# EasyEDA Pro project C116.epro

# Schematic Schematic1
Board Name: Board1; Create Date: 2026-06-16; Page Name: P1; Project Name: Tiny MCU; Schematic Name: Schematic1; Update Date: 2026-06-16; Company: EasyEDA.com; Page Size: A4; Version: V1.0
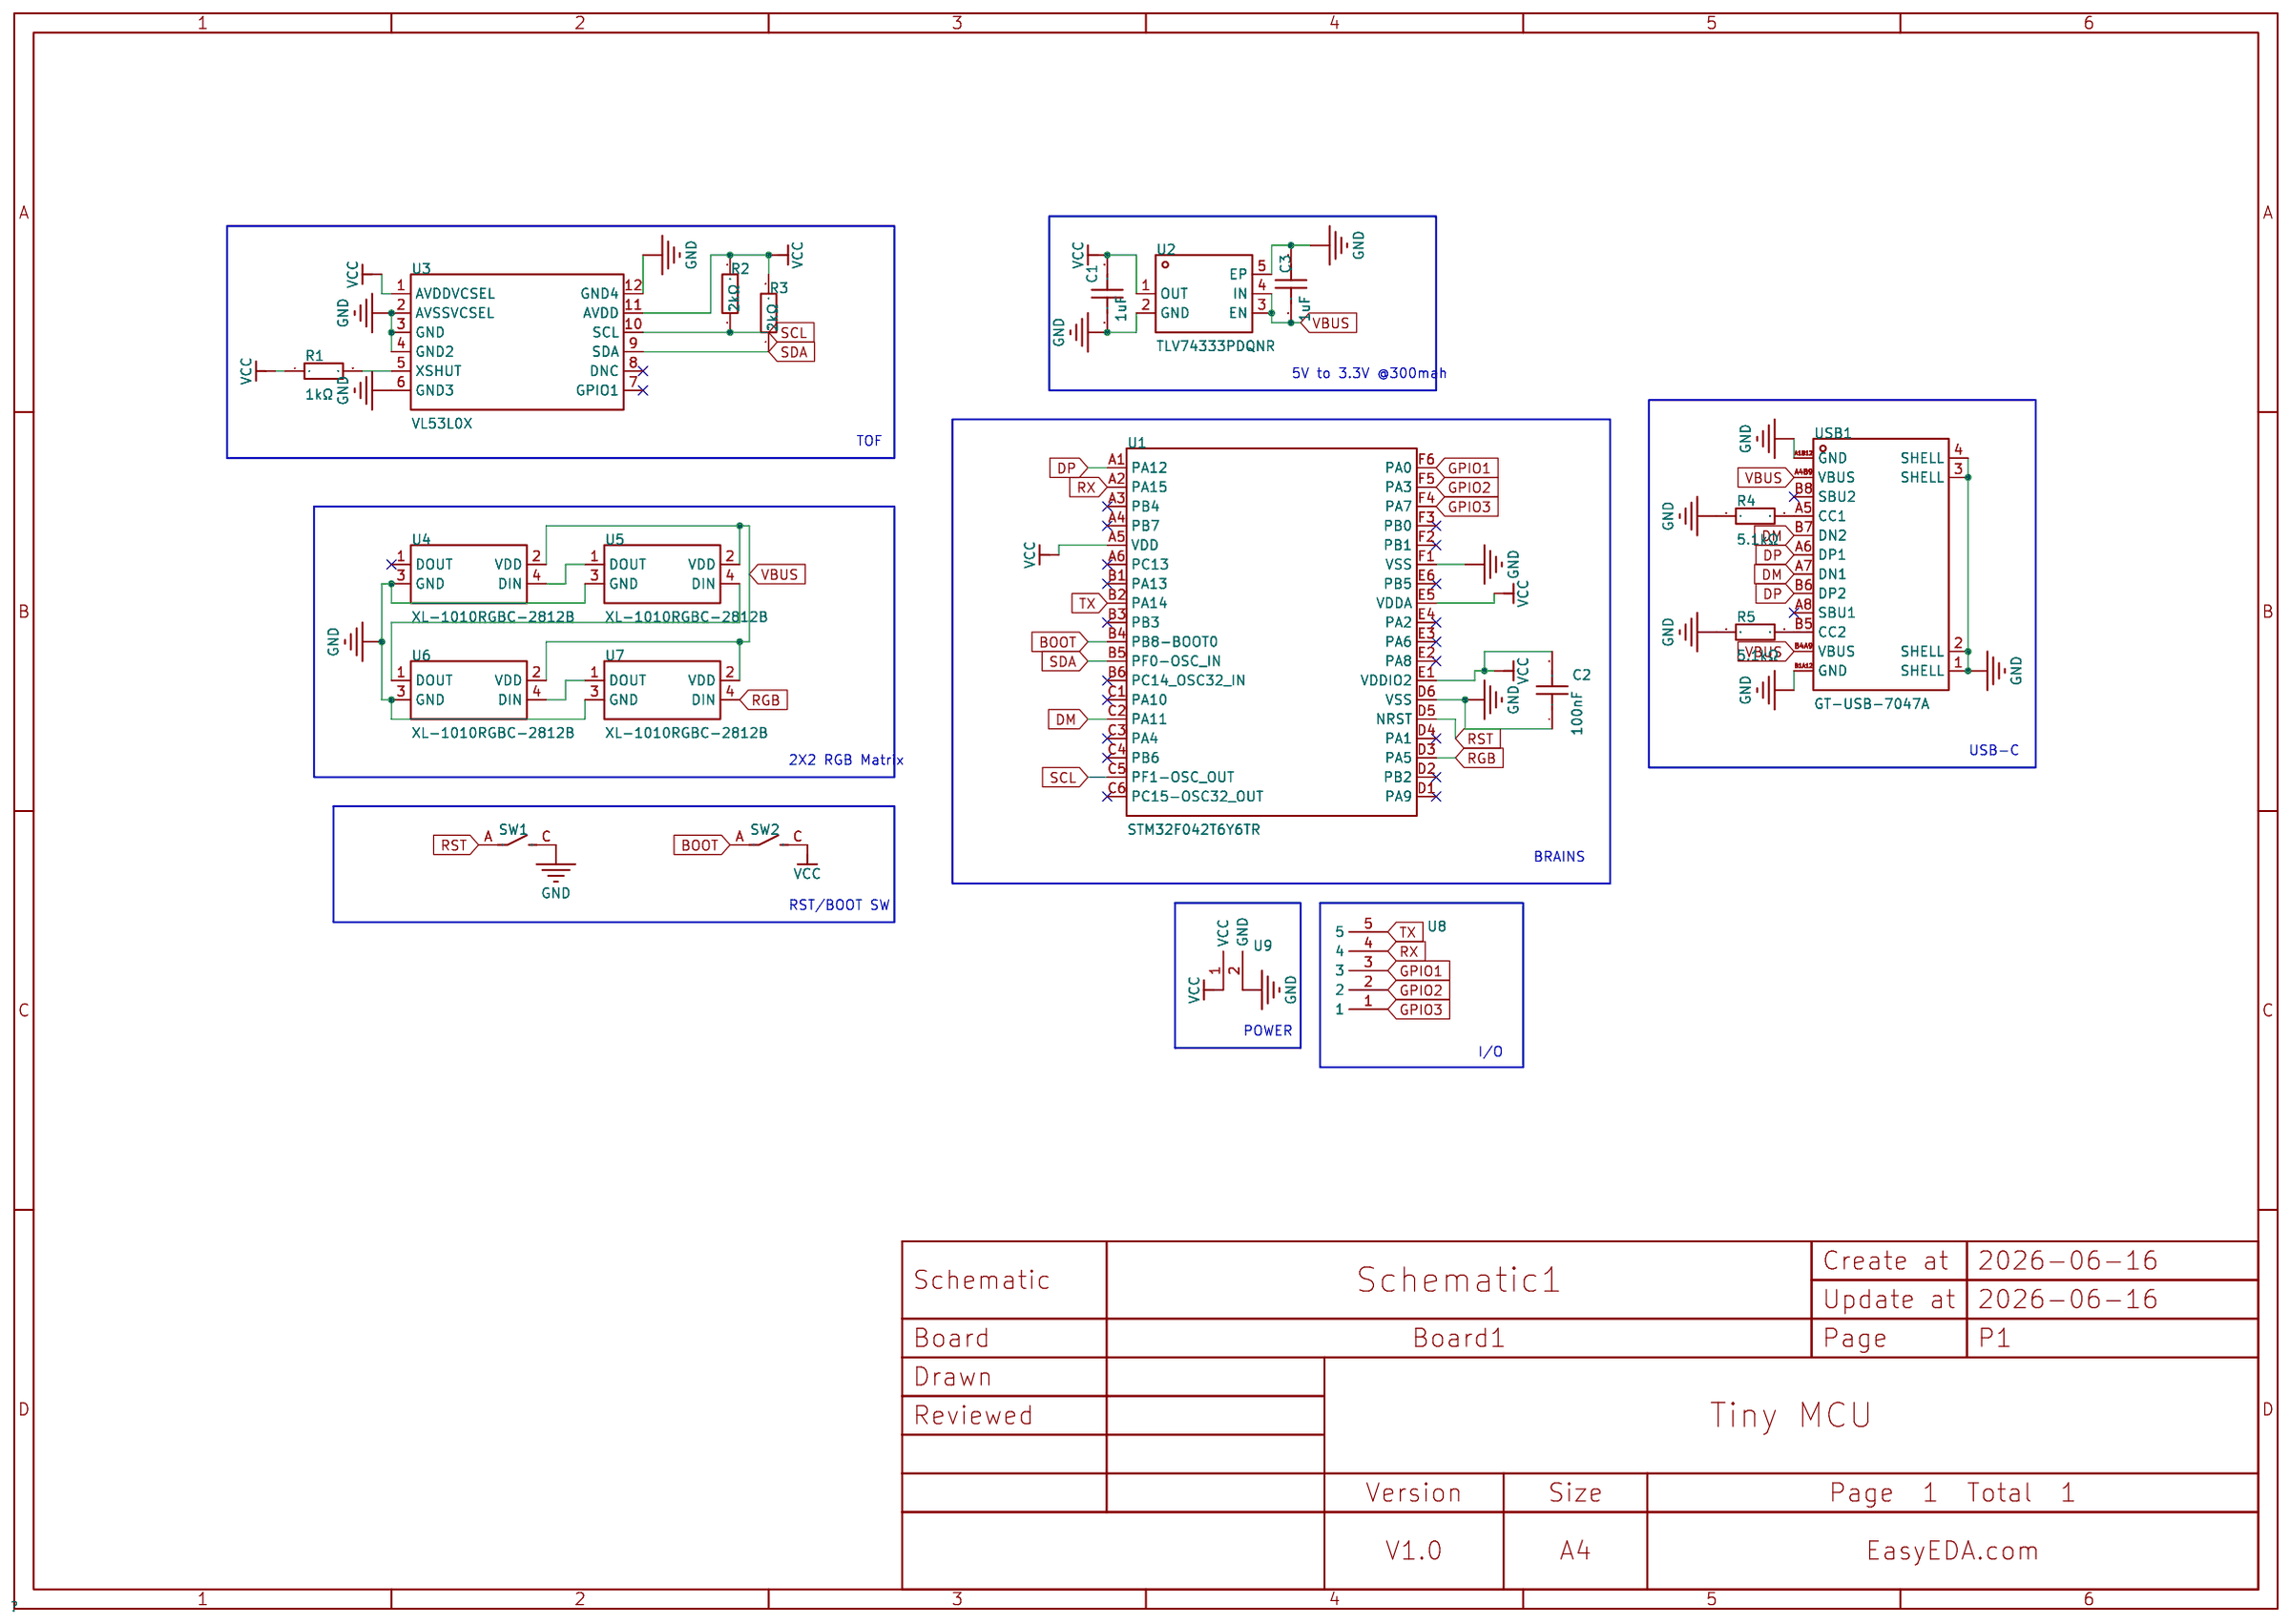
[diagram p0: schematic sheet]

## Parts
C1  1uF  [C0201]
C2  100nF  [C0201]
C3  1uF  [C0201]
R1  1kΩ  [R0201]
R2  2kΩ  [R0201]
R3  2kΩ  [R0201]
R4  5.1kΩ  [R0201]
R5  5.1kΩ  [R0201]
SW1  GT-TC194A-H0055-L1  [SW-SMD_4P-L2.5-W1.6-LS2.9_STI-055A12AX]
SW2  GT-TC194A-H0055-L1  [SW-SMD_4P-L2.5-W1.6-LS2.9_STI-055A12AX]
U1  STM32F042T6Y6TR  [WLCSP-36_L2.7-W2.6-R-C6-P0.40-BL]
U2  TLV74333PDQNR  [X2SON-4_L1.0-W1.0-P0.65-TL-EP]
U3  VL53L0X  [LGA-12_L4.4-W2.4_VL53L0X]
U4  XL-1010RGBC-2812B  [LED-SMD_4P-L1.0-W1.0-TL_XL-1010RGBC-WS2812B]
U5  XL-1010RGBC-2812B  [LED-SMD_4P-L1.0-W1.0-TL_XL-1010RGBC-WS2812B]
U6  XL-1010RGBC-2812B  [LED-SMD_4P-L1.0-W1.0-TL_XL-1010RGBC-WS2812B]
U7  XL-1010RGBC-2812B  [LED-SMD_4P-L1.0-W1.0-TL_XL-1010RGBC-WS2812B]
U8  -  [PAD'S]
U9  -  [POWER PADS]
USB1  GT-USB-7047A  [USB-C-SMD_GT-USB-7047A]

## Library data of the parts
C1 C3 = 0201X105M6R3CT: Capacitance:1uF Tolerance:±20% Tolerance:±20% Voltage Rating:6.3V Temperature Coefficient:X5R; LCSC Part Name: 1uF ±20% 6.3V; Supplier Part: C295898; Manufacturer: Walsin(华新科); Supplier Footprint: 0201; JLCPCB Part Class: Extended Part; Datasheet: https://item.szlcsc.com/datasheet/0201X105M6R3CT/280318.html; Supplier: LCSC; Tolerance: ±20%; Voltage Rating: 6.3V; Temperature Coefficient: X5R
C2 = GRM033C71C104KE14J: Capacitance:100nF Tolerance:±10% Tolerance:±10% Voltage Rating:16V Temperature Coefficient:-; LCSC Part Name: 100nF ±10% 16V; Supplier Part: C2184667; Manufacturer: muRata(村田); Supplier Footprint: 0201; JLCPCB Part Class: Extended Part; Datasheet: https://atta.szlcsc.com/upload/public/pdf/source/20210427/4D103D8029A243004EC7FB4DE54FB319.pdf; Supplier: LCSC; Tolerance: ±10%; Voltage Rating: 16V
R1 = CR0201JH0102G: Type:Thick Film Resistor Resistance:1kΩ Tolerance:±5% Tolerance:±5% Power(Watts):50mW Voltage-Supply(Max):25V Temperature Coefficient:±250ppm/℃ Temperature Coefficient:±250ppm/℃ Operating Temperature:-55℃~+125℃ Operating Temperature:-55℃~+125℃; LCSC Part Name: 厚膜电阻 1kΩ ±5% 50mW; Supplier Part: C100150; Manufacturer: LIZ(丽智电子); Supplier Footprint: 0201; JLCPCB Part Class: Extended Part; Datasheet: https://item.szlcsc.com/datasheet/CR0201JH0102G/101365.html; Supplier: LCSC; Type: Thick Film Resistor; Tolerance: ±5%; Power(Watts): 50mW; Voltage-Supply(Max): 25V; Temperature Coefficient: ±250ppm/℃; Operating Temperature: -55℃~+125℃
R2 R3 = CR0201JH0202G: Type:Thick Film Resistors Resistance: Tolerance:±5% Tolerance:±5% Power(Watts): Overload Voltage (Max): Temperature Coefficient:±250ppm/℃ Temperature Coefficient:±250ppm/℃ Operating Temperature Range:-55℃~+125℃ Operating Temperature Range:-55℃~+125℃; LCSC Part Name: 厚膜电阻 2kΩ ±5% 50mW; Supplier Part: C100158; Manufacturer: LIZ(丽智电子); Supplier Footprint: 0201; JLCPCB Part Class: Extended Part; Datasheet: https://atta.szlcsc.com/upload/public/pdf/source/20180403/C189438_6D658388CC7843F35BBC9018D03F0B8E.pdf; Supplier: LCSC; Type: Thick Film Resistors; Tolerance: ±5%; Temperature Coefficient: ±250ppm/℃; Operating Temperature Range: -55℃~+125℃
R4 R5 = RC0201JR-075K1L: Type:Thick Film Resistors Resistance: Tolerance:±5% Tolerance:±5% Power(Watts): Overload Voltage (Max): Temperature Coefficient:±200ppm/℃ Temperature Coefficient:±200ppm/℃ Operating Temperature Range:-55℃~+125℃ Operating Temperature Range:-55℃~+125℃; LCSC Part Name: 厚膜电阻 5.1kΩ ±5% 50mW; Supplier Part: C163490; Manufacturer: YAGEO(国巨); Supplier Footprint: 0201; JLCPCB Part Class: Extended Part; Datasheet: https://atta.szlcsc.com/upload/public/pdf/source/20181009/C309620_DA5935B6E1D48212CB7A533FE518B3C2.pdf; Supplier: LCSC; Type: Thick Film Resistors; Tolerance: ±5%; Temperature Coefficient: ±200ppm/℃; Operating Temperature Range: -55℃~+125℃
SW1 SW2 = GT-TC194A-H0055-L1: Circuit:SPST Actuator Style:Round Button Operating Force:1.6N Mounting Type:Surface Mount,Vertical Length:2.5mm Width:1.6mm Switch Height:0.55mm with Bracket:Without Bracket Contact Current:50mA Voltage Rating:12V Actuator/Cap Color:Black With Lamp:No Ter; LCSC Part Name: 2.5*1.6轻触开关; Supplier Part: C41398745; Manufacturer: G-Switch(品赞); Supplier Footprint: SMD,2.5x1.6mm; JLCPCB Part Class: Extended Part; Datasheet: https://item.szlcsc.com/datasheet/GT-TC194A-H0055-L1/43192386.html; Supplier: LCSC; Circuit: SPST; Actuator Style: Round Button; Operating Force: 1.6N; Mounting Type: Surface Mount,Vertical; Length: 2.5mm; Width: 1.6mm; Switch Height: 0.55mm; with Bracket: Without Bracket; Contact Current: 50mA; Voltage Rating: 12V; Actuator/Cap Color: Black; With Lamp: No; Termination Style: SMD(SMT) Tab; Life: 100,000 Cycles; Operating Temperature: -40℃~+85℃
U1 = STM32F042T6Y6TR: CPU Core:ARM-M0 CPU Maximum Speed:48MHz Program Storage Size:32KB Program Memory Type:FLASH Number of I/O:30 ADC (Bit):12bit Voltage - Supply:1.65V~3.6V Voltage - Supply:1.65V~3.6V Applications:-; LCSC Part Name: 主流ARM Cortex-M0 USB系列MCU，具有32 KB Flash、48 MHz CPU、USB、CAN和CEC功能; Supplier Part: C2054374; Manufacturer: ST(意法半导体); Supplier Footprint: WLCSP-36; JLCPCB Part Class: Extended Part; Datasheet: https://item.szlcsc.com/datasheet/STM32F042T6Y6TR/2145946.html; Supplier: LCSC; CPU Core: ARM-M0; CPU Maximum Speed: 48MHz; Program Storage Size: 32KB; Program Memory Type: FLASH; Number of I/O: 30; ADC (Bit): 12bit; Voltage - Supply: 1.65V~3.6V
U2 = TLV74333PDQNR: Output Configuration:Positive Voltage - Supply:5.5V Output Voltage:3.3V Output Voltage:3.3V Output Current:300mA Power Supply Rejection Ratio (PSRR):35dB@(1kHz) Voltage Dropout:220mV@(300mA) standby current:34uA Noise:120uVrms Features:Over Current Protec; LCSC Part Name: 3.3V 300mA 5.5V; Supplier Part: C469880; Manufacturer: TI(德州仪器); Supplier Footprint: X2SON-4-EP(1x1); JLCPCB Part Class: Extended Part; Datasheet: https://www.ti.com/cn/lit/ds/symlink/tlv743p.pdf; Supplier: LCSC; Output Configuration: Positive; Voltage - Supply: 5.5V; Output Voltage: 3.3V; Output Current: 300mA; Power Supply Rejection Ratio (PSRR): 35dB@(1kHz); Voltage Dropout: 220mV@(300mA); standby current: 34uA; Noise: 120uVrms; Features: Over Current Protection；Enable control；Output discharge；Input under-voltage protection；Short Circuit Protection；Thermal shutdown; Operating Temperature: -40℃~+125℃@(Tj); Output Type: Fixed; Number of Outputs: 1
U3 = VL53L0X: Supplier Part: C2929940; Supplier Footprint: LGA-12; JLCPCB Part Class: Extended Part; Supplier: LCSC
U4-U7 = XL-1010RGBC-2812B: Wavelength:620nm~625nm；465nm~475nm；520nm~530nm Luminous Intensity:300mcd；800mcd；200mcd Fixed-Frequency Pwm Mode:1kHz Data Transmission Rate:800Kbit/s Voltage - Supply:4.5V~5.5V Voltage - Supply:4.5V~5.5V Quiescent Current:0.35mA Lens Color:Water Clear ESD; LCSC Part Name: XL-1010RGBC-WS2812B; Supplier Part: C5349953; Manufacturer: XINGLIGHT(成兴光); Supplier Footprint: SMD,1x1mm; JLCPCB Part Class: Extended Part; Datasheet: https://item.szlcsc.com/datasheet/XL-1010RGBC-2812B/6136402.html; Supplier: LCSC; Wavelength: 620nm~625nm；465nm~475nm；520nm~530nm; Luminous Intensity: 300mcd；800mcd；200mcd; Fixed-Frequency Pwm Mode: 1kHz; Data Transmission Rate: 800Kbit/s; Voltage - Supply: 4.5V~5.5V; Quiescent Current: 0.35mA; Lens Color: Water Clear; ESD Withstand Voltage: 2000V; Installation method: Top-mount; Operating Temperature: -20℃~+85℃; Peak Wavelength: R:625nm；B:470nm；G:525nm; Viewing Angle: 120°; Length: 1mm; Width: 0.8mm; Height: 1mm
U8 = pad's for tiny mcu
U9 = POWER PAD'S
USB1 = GT-USB-7047A: Connector Type:Type-C Standard:USB 2.0 Gender:Female Mounting Style:Horizontal attachment Number of Contacts:16P Number of Ports:1 Current Rating - Power (Max):5A Rated Voltage (Max):24V Connect-Disconnect Life:10,000 times Center Height:1.63mm Length:7.3; LCSC Part Name: Type-C 母 卧贴; Supplier Part: C963216; Manufacturer: G-Switch(品赞); Supplier Footprint: SMD; JLCPCB Part Class: Extended Part; Datasheet: https://atta.szlcsc.com/upload/public/pdf/source/20231219/24E624EB9DE46AB785D7B5DEC52507E7.pdf; Supplier: LCSC; Connector Type: Type-C; Standard: USB 2.0; Gender: Female; Mounting Style: Horizontal attachment; Number of Contacts: 16P; Number of Ports: 1; Current Rating - Power (Max): 5A; Rated Voltage (Max): 24V; Connect-Disconnect Life: 10,000 times; Center Height: 1.63mm; Length: 7.35mm; Core Colour: Black; Operating Temperature Range: -40℃~+85℃

## Nets
GND: C1.1 C2.1 C3.2 R4.1 R5.1 SW1.C U1.D6(VSS) U1.F1(VSS) U2.2(GND) U2.5(EP) U3.2(AVSSVCSEL) U3.3(GND) U3.4(GND2) U3.6(GND3) U3.12(GND4) U4.3(GND) U5.3(GND) U6.3(GND) U7.3(GND) U9.2(GND) USB1.1(SHELL) USB1.2(SHELL) USB1.3(SHELL) USB1.4(SHELL) USB1.A1B12(GND) USB1.B1A12(GND)
VBUS: C3.1 U2.3(EN) U2.4(IN) U4.2(VDD) U5.2(VDD) U6.2(VDD) U7.2(VDD) USB1.A4B9(VBUS) USB1.B4A9(VBUS)
VCC: C1.2 C2.2 R1.1 R2.2 R3.2 SW2.C U1.A5(VDD) U1.E1(VDDIO2) U1.E5(VDDA) U2.1(OUT) U3.1(AVDDVCSEL) U3.11(AVDD) U9.1(VCC)
BOOT: SW2.A U1.B4(PB8-BOOT0)
DM: U1.C2(PA11) USB1.A7(DN1) USB1.B7(DN2)
DP: U1.A1(PA12) USB1.A6(DP1) USB1.B6(DP2)
GPIO1: U1.F6(PA0) U8.3
GPIO2: U1.F5(PA3) U8.2
GPIO3: U1.F4(PA7) U8.1
RGB: U1.D3(PA5) U7.4(DIN)
RST: SW1.A U1.D5(NRST)
RX: U1.A2(PA15) U8.4
SCL: R2.1 U1.C5(PF1-OSC_OUT) U3.10(SCL)
SDA: R3.1 U1.B5(PF0-OSC_IN) U3.9(SDA)
TX: U1.B2(PA14) U8.5
$1N35: R1.2 U3.5(XSHUT)
$1N39: U4.4(DIN) U5.1(DOUT)
$1N40: U6.4(DIN) U7.1(DOUT)
$1N45: U5.4(DIN) U6.1(DOUT)
$1N48: R4.2 USB1.A5(CC1)
$1N49: R5.2 USB1.B5(CC2)

Not connected (* = marked no-connect by the designer): U1 A3(PB4)* A4(PB7)* A6(PC13)* B1(PA13)* B3(PB3)* B6(PC14_OSC32_IN)* C1(PA10)* C3(PA4)* C4(PB6)* C6(PC15-OSC32_OUT)* D1(PA9)* D2(PB2)* D4(PA1)* E2(PA8)* E3(PA6)* E4(PA2)* E6(PB5)* F2(PB1)* F3(PB0)*; U3 7(GPIO1)* 8(DNC)*; U4 1(DOUT)*; USB1 A8(SBU1)* B8(SBU2)*

## Notes on the sheet
- 5V to 3.3V @300mah
- TOF
- 2X2 RGB Matrix
- USB-C
- BRAINS
- RST/BOOT SW
- POWER
- I/O

# Board PCB1
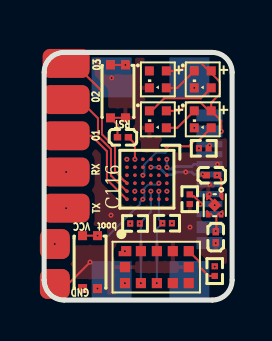
[diagram p1: board, top side]
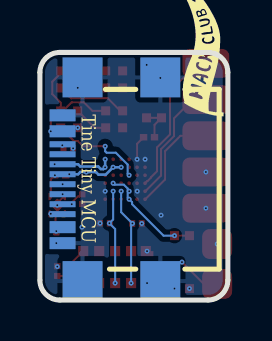
[diagram p2: board, bottom side, seen from below]

Outline 9.42 x 12.4 mm; copper layers: Top Layer, Inner1, Inner2, Bottom Layer. Coordinates in mm from the lower left corner of the outline.
Outline path: 0,11.4 0,1 arc(0.29,0.29) 1,0 8.42,0 arc(9.13,0.29) 9.42,1 9.42,11.4 arc(9.13,12.11) 8.42,12.4 1,12.4 arc(0.29,12.11) 0,11.4
Stack: Top Layer 0.035mm Outer layer thickness 1oz / Dielectric1 0.2104mm 7628 RC49% 8.6mil / Inner1 0.0152mm Inner layer thickness / Dielectric2 1.065mm 1.1mm H/HOZ Copper / Inner2 0.0152mm Inner layer thickness / Dielectric3 0.2104mm 7628 RC49% 8.6mil / Bottom Layer 0.035mm Outer layer thickness 1oz

## Design rules (mm)
net DM: DP1
net DP: DP1
spacing copperThickness1oz (default): track to track 0.102, other pairs 0.152 to 0.3
spacing copperThickness2oz: track to track 0.203, other pairs 0.152 to 0.3
track width copperThickness1oz: min 0.127, default 0.254, max 2.54
track width copperThickness2oz: min 0.203, default 0.254, max 2.54
track width 0.1 (default): min 0.075, default 0.1, max 0.1
differential pair differentialPair (default): width min 0.127, default 0.254, max 2.54; gap min 0.152, default 0.152
net VCC uses copperRegion
net GND uses copperRegion

## Placement (name value [footprint] x y rotation side)
C1  1uF  [C0201]  8.4 6.25 0 top
C2  100nF  [C0201]  3.95 8.15 0 top
C3  1uF  [C0201]  8.6 3.15 270 top
R1  1kΩ  [R0201]  8.55 1.45 270 top
R2  2kΩ  [R0201]  4.56 3.83 180 top
R3  2kΩ  [R0201]  6.16 3.85 0 top
R4  5.1kΩ  [R0201]  7.3 5.05 90 top
R5  5.1kΩ  [R0201]  8 7.6 0 top
SW1  GT-TC194A-H0055-L1  [SW-SMD_4P-L2.5-W1.6-LS2.9_STI-055A12AX]  3.7 10.45 270 top
SW2  GT-TC194A-H0055-L1  [SW-SMD_4P-L2.5-W1.6-LS2.9_STI-055A12AX]  2.3 1.9 270 top
U1  STM32F042T6Y6TR  [WLCSP-36_L2.7-W2.6-R-C6-P0.40-BL]  5.15 6.05 180 top
U2  TLV74333PDQNR  [X2SON-4_L1.0-W1.0-P0.65-TL-EP]  8.55 4.75 270 top
U3  VL53L0X  [LGA-12_L4.4-W2.4_VL53L0X]  5.65 1.65 180 top
U4  XL-1010RGBC-2812B  [LED-SMD_4P-L1.0-W1.0-TL_XL-1010RGBC-WS2812B]  5.7 11.05 0 top
U5  XL-1010RGBC-2812B  [LED-SMD_4P-L1.0-W1.0-TL_XL-1010RGBC-WS2812B]  7.95 11.05 0 top
U6  XL-1010RGBC-2812B  [LED-SMD_4P-L1.0-W1.0-TL_XL-1010RGBC-WS2812B]  5.7 9.05 0 top
U7  XL-1010RGBC-2812B  [LED-SMD_4P-L1.0-W1.0-TL_XL-1010RGBC-WS2812B]  7.95 9.05 0 top
U8  -  [PAD'S]  -0.15 12.6 270 top
U9  -  [POWER PADS]  0.54 3.06 270 top
USB1  GT-USB-7047A  [USB-C-SMD_GT-USB-7047A]  5.84 6.05 90 bottom

## Footprints (pads in the part's own frame, mm; a bottom-side part is the same pattern mirrored in y, then rotated)
C0201
  rect 0.368x0.324 smd: 1(-0.275,0) 2(0.275,0)
LED-SMD_4P-L1.0-W1.0-TL_XL-1010RGBC-WS2812B
  rect 0.45x0.45 smd: 1(-0.425,0.424) 2(0.425,0.425) 3(-0.425,-0.425) 4(0.425,-0.425)
LGA-12_L4.4-W2.4_VL53L0X
  custom 0.635x0.508 smd: 1(1.6,-0.8)
  rect 0.508x0.508 smd: 2(0.8,-0.8) 3(0,-0.8) 4(-0.8,-0.8) 5(-1.6,-0.8) 6(-1.6,0) 7(-1.6,0.8) 8(-0.8,0.8) 9(0,0.8) 10(0.8,0.8) 11(1.6,0.8) 12(1.6,0)
PAD'S
  rrect 1.45x2.35 smd: 1(0.75,1.25) 2(2.562,1.25) 3(4.375,1.25) 4(6.188,1.25) 5(8,1.25)
POWER PADS
  rrect 1.5x1.5 smd: 1(0.254,0) 2(2.254,0)
R0201
  rect 0.303x0.324 smd: 1(-0.241,0) 2(0.241,0)
SW-SMD_4P-L2.5-W1.6-LS2.9_STI-055A12AX
  rect 0.45x0.45 smd: A(-1.325,0.375) A(-1.325,-0.375) C(1.325,0.375) C(1.325,-0.375)
USB-C-SMD_GT-USB-7047A
  rect 2x2 smd: 1(-5.1,1.45) 2(5.1,1.45) 3(5.1,-2.45) 4(-5.1,-2.45)
  rect 0.6x1.3 smd: A1B12(-3.2,2.45) A4B9(-2.4,2.45) B1A12(3.2,2.45) B4A9(2.4,2.45)
  rect 0.3x1.3 smd: A5(-1.25,2.45) A6(-0.25,2.45) A7(0.25,2.45) A8(1.25,2.45) B5(1.75,2.45) B6(0.75,2.45) B7(-0.75,2.45) B8(-1.75,2.45)
WLCSP-36_L2.7-W2.6-R-C6-P0.40-BL
  round 0.187 smd: A1(-1,-1) A2(-1,-0.6) A3(-1,-0.2) A4(-1,0.2) A5(-1,0.6) A6(-1,1) B1(-0.6,-1) B2(-0.6,-0.6) B3(-0.6,-0.2) B4(-0.6,0.2) B5(-0.6,0.6) B6(-0.6,1) C1(-0.2,-1) C2(-0.2,-0.6) C3(-0.2,-0.2) C4(-0.2,0.2) C5(-0.2,0.6) C6(-0.2,1) D1(0.2,-1) D2(0.2,-0.6) D3(0.2,-0.2) D4(0.2,0.2) D5(0.2,0.6) D6(0.2,1) E1(0.6,-1) E2(0.6,-0.6) E3(0.6,-0.2) E4(0.6,0.2) E5(0.6,0.6) E6(0.6,1) F1(1,-1) F2(1,-0.6) F3(1,-0.2) F4(1,0.2) F5(1,0.6) F6(1,1)
X2SON-4_L1.0-W1.0-P0.65-TL-EP
  custom 0.36x0.22 smd: 1(-0.43,0.325) 2(-0.43,-0.325) 3(0.43,-0.325) 4(0.43,0.325)
  rect 0.48x0.48 smd rot 45: 5(0,0)

## Nets
As in the schematic.

Pads without a net: U1 A3 A4 A6 B1 B3 B6 C1 C3 C4 C6 D1 D2 D4 E2 E3 E4 E6 F2 F3; U3 7 8; U4 1; USB1 A8 B8

## Via types
v1: diameter 0.25, hole 0.1, Top Layer to Bottom Layer, 51 vias

## Routing (per net, layer and track width the routed paths; a pad name or vN(x,y) marks a point on that pad's centre or on a via; arc(x,y) is an arc through that point)
GND: length 4.7
  Top Layer w0.1: v1(8.55,4.75) 8.55,4.86 8.22,5.18 ; SW1.C SW1.C 3.68,8.77 C2.1 ; v1(2.3,1.9) 1.21,0.81 U9.2
  vias: v1(3.35,4.25) v1(3.38,11.12) v1(4.15,7.05) v1(4.95,5.05) v1(7.1,6.41) v1(7.31,3.65) v1(7.53,10.62) v1(7.53,8.62) v1(7.76,7.6) v1(8.6,2.85)
VBUS: length 14.5
  Top Layer w0.1: 6.12,11.48 6.79,11.48 7.22,11.9 7.83,11.9 8.26,11.48 8.38,11.48 8.38,11.36 8.8,10.93 8.8,10.32 8.38,9.89 8.38,9.48 ; 8.38,9.48 8.26,9.48 7.83,9.9 7.22,9.9 6.79,9.48 6.12,9.48 ; 8.38,9.48 8.88,8.97 v1(8.88,8.45) ; 8.63,4.21 8.47,4.21 8.35,4.32 8.22,4.32 ; 8.63,4.21 8.63,3.48 v1(8.6,3.45) ; 8.63,4.21 8.75,4.32 v1(8.88,4.32)
  Inner1 w0.1: v1(8.88,8.45) 8.88,6.51 9,6.39 9,6.11 8.88,6 8.88,4.32 v1(8.88,4.32)
VCC: length 3.7
  Top Layer w0.1: C1.2 8.88,6.05 U2.1 ; C2.2 4.55,7.82 v1(4.55,7.05)
  Inner2 w0.1: 7.55,6.7 8.22,6.7 v1(8.67,6.25)
  vias: v1(0.54,2.81) v1(1.93,0.58) v1(2.68,0.58) v1(4.05,2.45) v1(4.05,0.85) v1(4.31,3.83) v1(4.54,5.45) v1(6.15,5.45) v1(6.41,3.85) v1(8.55,1.67)
BOOT: length 5.2
  Top Layer w0.1: SW2.A v1(2.68,3.23)
  Bottom Layer w0.1: v1(2.68,3.23) 3.22,3.23 4.8,4.8 4.8,4.9 5.02,5.12 5.02,5.59 5.21,5.78 5.68,5.78 v1(5.75,5.85)
DM: length 4.2
  Inner2 w0.127: v1(8.28,5.3) 8,5.3 7.9,5.4 7.9,5.9 8,6 8,6.25 v1(7.95,6.3)
  Bottom Layer w0.127: v1(5.35,6.65) 5.75,6.65 6.12,6.28 6.48,6.28 6.61,6.41 7.4,6.41 7.51,6.3 v1(7.95,6.3)
DP: length 4.8
  Inner2 w0.127: v1(8.28,5.8) 8.7,5.8 9.01,6.11 9.01,6.39 8.95,6.45 8.95,6.49 8.69,6.75 v1(8.69,6.8)
  Bottom Layer w0.127: v1(8.69,6.8) 7.51,6.8 7.4,6.69 6.5,6.69 6.37,6.56 6.24,6.56 6.15,6.65 v1(6.15,7.05)
GPIO1: length 5.2
  Top Layer w0.1: U1.F6 4.13,5.05 3.15,6.04 3.15,7.45 2.38,8.23 U8.3
GPIO2: length 6.2
  Top Layer w0.1: U8.2 1.76,10.04 2.7,9.1 2.7,8.21 3.35,7.56 3.35,6.23 4.13,5.45 U1.F5
GPIO3: length 7.5
  Top Layer w0.1: U1.F4 4.05,5.95 4.03,5.95 3.85,6.13 3.85,6.15 3.55,6.45 3.55,7.64 2.9,8.3 2.9,9.43 2.9,9.44 2.9,10.45 1.5,11.85 U8.1
RGB: length 4.8
  Top Layer w0.1: v1(6.15,7.7) 7.26,7.7 7.52,7.96 7.71,7.96 U7.4
  Bottom Layer w0.1: v1(6.15,7.7) 6.15,7.45 6.08,7.38 5.61,7.38 5.02,6.79 5.02,6.32 v1(4.95,6.25)
RST: length 7.4
  Top Layer w0.1: SW1.A v1(4.07,11.78)
  Inner2 w0.1: v1(4.95,5.45) 4.95,5.79 4.07,6.67 v1(4.07,11.78)
RX: length 7.9
  Inner1 w0.1: v1(6.15,6.65) 6.21,6.65 6.48,6.91 6.48,7.84 6.29,8.03 6.01,8.03 5.82,7.84 5.82,7.19 ; 5.82,7.18 5.42,7.18 4.89,6.65 1.34,6.65 v1(1.1,6.41)
SCL: length 4.9
  Bottom Layer w0.1: v1(5.35,5.45) 5.35,4.4 v1(4.78,3.83) 4.85,3.77 v1(4.85,0.85)
SDA: length 4.8
  Bottom Layer w0.1: v1(5.75,5.45) 5.75,4.04 v1(5.94,3.85) 5.65,3.56 v1(5.65,0.85)
TX: length 5.5
  Inner1 w0.1: v1(5.75,6.65) 5.68,6.57 5.68,6.51 5.01,5.85 4.35,5.85 3.1,4.6 v1(1.1,4.6)
$1N35: length 2
  Top Layer w0.1: U3.5 7.8,1.9 7.8,1.65 8.24,1.21 R1.2
$1N39: length 1.8
  Top Layer w0.1: U4.4 6.68,10.62 U5.1
$1N40: length 1.8
  Top Layer w0.1: U7.1 6.68,8.62 U6.4
$1N45: length 3.6
  Top Layer w0.1: 5.28,9.47 5.39,9.47 6.02,10.1 7.85,10.1 U5.4
$1N48: length 0.8
  Top Layer w0.1: R4.2 7.33,5.29 7.43,5.19 7.52,5.19 7.82,4.88 v1(7.82,4.8)
$1N49:
  vias: v1(8.3,7.75)

## Copper pours and planes (outline as drawn; the poured copper is in the pictures)
GND on Top Layer: -0.15,12.6 9.42,12.6 9.42,-0.19 -0.15,-0.19
GND on Bottom Layer: -0.2,12.6 9.42,12.6 9.42,-0.19 -0.2,-0.19
GND on Inner1: -0.2,12.6 9.55,12.6 9.55,-0.25 -0.2,-0.25
VCC on Inner2: -0.2,12.55 9.5,12.55 9.5,-0.2 -0.2,-0.2

## Text on the board
Bottom Silkscreen Layer: Tine Tiny MCU
Top Silkscreen Layer: 01 | 02 | RX | TX | 03 | GND | VCC | boot | RST | C116
